# EAGLE design pong (EAGLE 6.2)
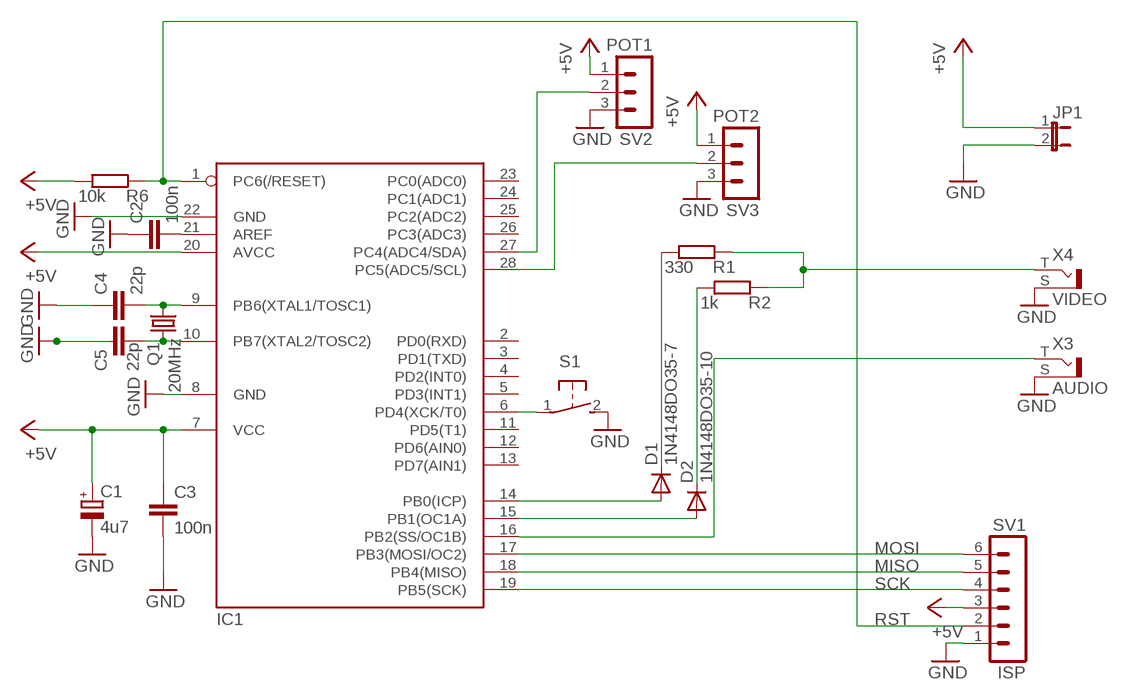
[diagram p0: schematic, sheet 1]

## Parts
C1  4u7  CPOL-EUTT5D7  [TT5D7]
C2  100n  C-EU025-024X044  [C025-024X044]
C3  100n  C-EU025-024X044  [C025-024X044]
C4  22p  C-EU025-024X044  [C025-024X044]
C5  22p  C-EU050-025X075  [C050-025X075]
D1  1N4148DO35-7  [DO35-7]
D2  1N4148DO35-10  [DO35-10]
IC1  MEGA8-P  [DIL28-3]
JP1  JP1E  [JP1]
Q1  20MHz  CRYSTALTC26V  [TC26V]
R1  330  R-EU_0204/5  [0204/5]
R2  1k  R-EU_0204/7  [0204/7]
R6  10k  R-EU_0207/15  [0207/15]
S1  31-XX  [B3F-31XX]
SV1  ISP  MA06-1  [MA06-1]
SV2  POT1  MA03-1  [MA03-1]
SV3  POT2  MA03-1  [MA03-1]
X3  AUDIO  WBTOR1  [WBTOR1]
X4  VIDEO  WBTOR1  [WBTOR1]

## Nets
+5V: C1.+ C3.1 IC1.7(VCC) IC1.20(AVCC) JP1.1 R6.1 SV1.3 SV2.1 SV3.1
GND: C1.- C2.1 C3.2 C4.1 C5.1 IC1.8(GND) IC1.22(GND) JP1.2 S1.2(S) SV1.1 SV2.3 SV3.3 X3.S X4.S
MISO: IC1.18(PB4(MISO)) SV1.5
MOSI: IC1.17(PB3(MOSI/OC2)) SV1.6
N$1: C2.2 IC1.21(AREF)
N$2: D1.A IC1.14(PB0(ICP))
N$3: IC1.27(PC4(ADC4/SDA)) SV2.2
N$4: IC1.28(PC5(ADC5/SCL)) SV3.2
N$5: D2.A IC1.15(PB1(OC1A))
N$6: D1.C R1.1
N$7: D2.C R2.1
N$9: IC1.6(PD4(XCK/T0)) S1.1(P)
N$11: R1.2 R2.2 X4.T
N$15: IC1.16(PB2(SS/OC1B)) X3.T
N$22: C4.2 IC1.9(PB6(XTAL1/TOSC1)) Q1.2
N$23: C5.2 IC1.10(PB7(XTAL2/TOSC2)) Q1.1
RST: IC1.1(PC6(/RESET)) R6.2 SV1.2
SCK: IC1.19(PB5(SCK)) SV1.4
Unconnected: IC1.2(PD0(RXD)) IC1.3(PD1(TXD)) IC1.4(PD2(INT0)) IC1.5(PD3(INT1)) IC1.11(PD5(T1)) IC1.12(PD6(AIN0)) IC1.13(PD7(AIN1)) IC1.23(PC0(ADC0)) IC1.24(PC1(ADC1)) IC1.25(PC2(ADC2)) IC1.26(PC3(ADC3))

## Library data of the parts
C1 = rcl:CPOL-EU: POLARIZED CAPACITOR, European symbol
C2-C5 = rcl:C-EU: CAPACITOR, European symbol
D1 D2 = diode:1N4148: DIODE high speed (Philips)
IC1 = atmel:MEGA8-P: MICROCONTROLLER 8 Kbytes FLASH, 1 kbytes SRAM, 512 bytes EEPROM, USART, 4-channel 10 bit ADC, 2-channel 8 bit ADC Pin compatible with Atmega48, ATMega88, ATMega168 Source: avr.lbr
JP1 = jumper:JP1E: JUMPER
Q1 = crystal:CRYSTAL: CRYSTAL
R1 R2 R6 = rcl:R-EU_: RESISTOR, European symbol
S1 = switch-omron:31-XX: OMRON SWITCH; MPN: B3F-3100; OC_FARNELL: 959704; OC_NEWARK: 36M3582
SV1 = con-lstb:MA06-1: PIN HEADER; OC_FARNELL: unknown; OC_NEWARK: unknown
SV2 SV3 = con-lstb:MA03-1: PIN HEADER; OC_FARNELL: unknown; OC_NEWARK: unknown
X3 X4 = con-lumberg:WBTOR1: RCA connectors according to JEITA RC-5231 Cinch RCA-Einbaukupplung nach JEITA RC-5231, abgewinkelte Ausführung Source: http://www.lumberg.de/Produkte/PDFs/WBTOR1.pdf; MPN: WBTOR 1 BLACK; OC_FARNELL: 1200146; OC_NEWARK: 98K2588

## Board
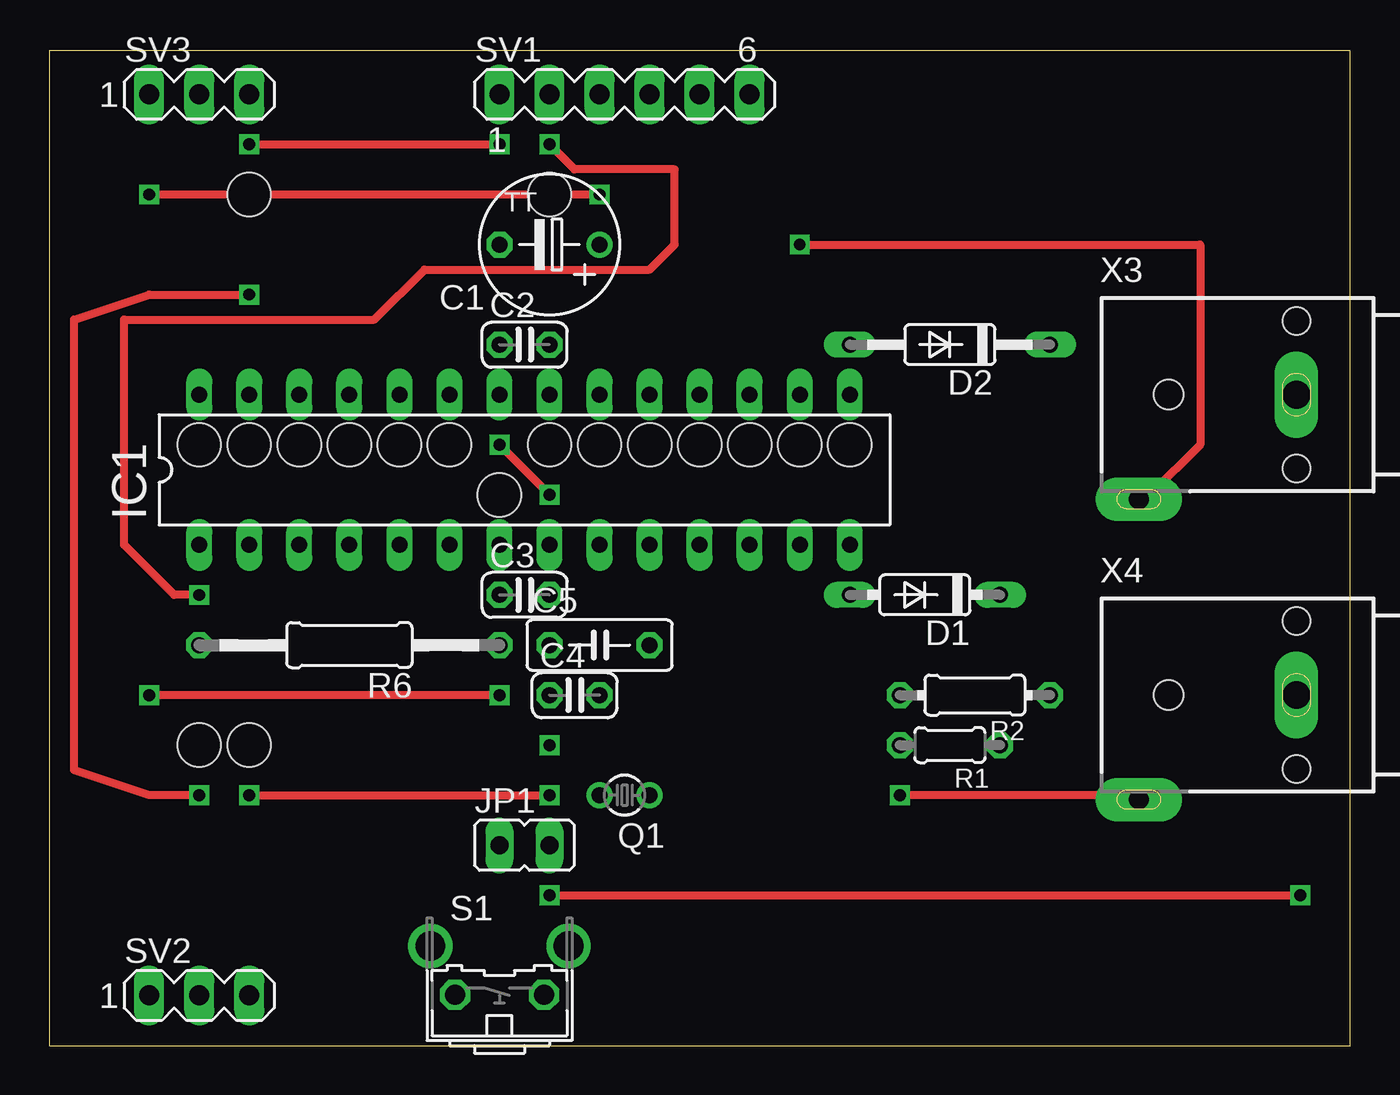
[diagram p1: board, top side]
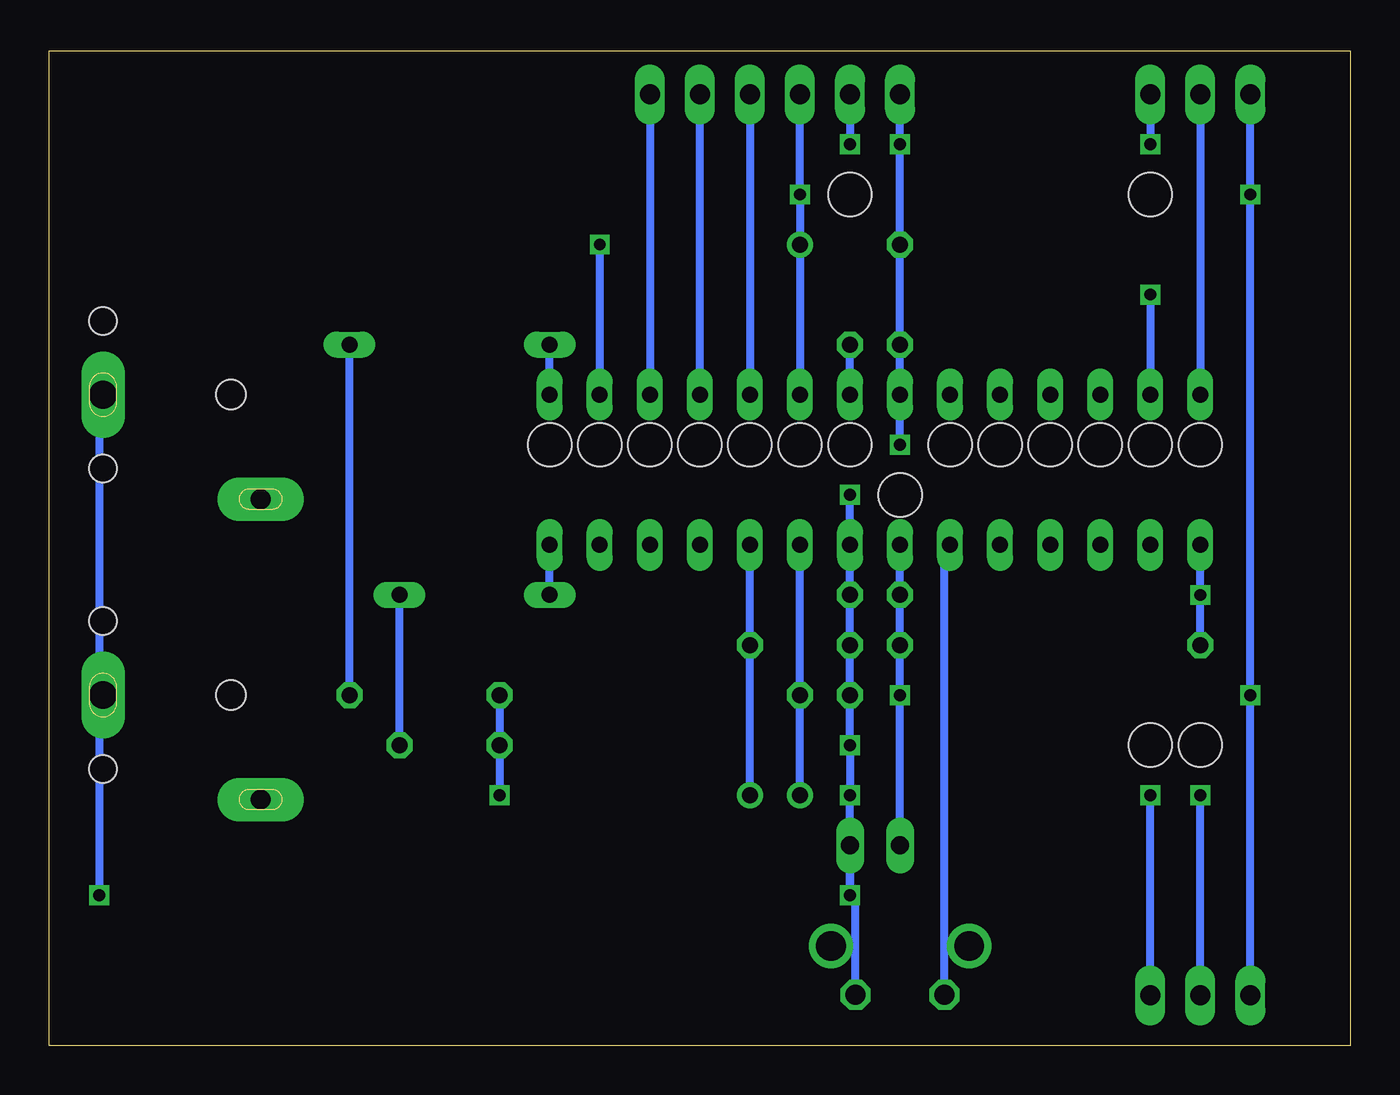
[diagram p2: board, bottom side, seen from below]

Size 66.03 x 50.47 mm. Coordinates in mm from the lower left corner, seen from the top.
Outline: 66.03,0 66.03,50.47 0,50.47 0,0 66.03,0
Copper layers (1*16): Top 0.035mm / dielectric 1.5mm / Bottom 0.035mm
Design rules: minimum track width 10mil, minimum drill 24mil, track to track 8mil, track to pad 8mil, pad to pad 8mil, via to via 8mil, smd to smd 8mil, copper to edge 40mil, drill to drill 8mil, minimum pad ring 10mil, minimum via ring 8mil, stop-mask expansion 4mil, vias tented up to drill 0mil, thermal gap 10mil
Holes 2.2 mm at 7.61,30.48 10.15,30.48 12.69,30.48 15.23,30.48 17.77,30.48 20.31,30.48 22.85,27.94 25.39,30.48 27.93,30.48 30.47,30.48 33.01,30.48 35.55,30.48 38.09,30.48 40.63,30.48 25.39,43.18 10.15,43.18 10.15,15.24 7.61,15.24

### Footprints (pad centres in the part's own frame; a part is rotated, then mirrored left to right if it is on the bottom)
TT5D7 = drill 0.813: + -2.54,0 | drill 0.813 octagon: - 2.54,0
C025-024X044 = drill 0.813 octagon: 1 -1.27,0; 2 1.27,0
C050-025X075 = drill 0.813 octagon: 1 -2.54,0; 2 2.54,0
DO35-7 = drill 0.813 long: A 3.81,0; C -3.81,0
DO35-10 = drill 0.813 long: A 5.08,0; C -5.08,0
DIL28-3 = drill 0.813 long: 1 -16.51,-3.81; 2 -13.97,-3.81; 3 -11.43,-3.81; 4 -8.89,-3.81; 5 -6.35,-3.81; 6 -3.81,-3.81; 7 -1.27,-3.81; 8 1.27,-3.81; 9 3.81,-3.81; 10 6.35,-3.81; 11 8.89,-3.81; 12 11.43,-3.81; 13 13.97,-3.81; 14 16.51,-3.81; 15 16.51,3.81; 16 13.97,3.81; 17 11.43,3.81; 18 8.89,3.81; 19 6.35,3.81; 20 3.81,3.81; 21 1.27,3.81; 22 -1.27,3.81; 23 -3.81,3.81; 24 -6.35,3.81; 25 -8.89,3.81; 26 -11.43,3.81; 27 -13.97,3.81; 28 -16.51,3.81
JP1 = drill 0.914 long: 1 0,-1.27; 2 0,1.27
TC26V = drill 0.813: 1 -1.27,0; 2 1.27,0
0204/5 = drill 0.813 octagon: 1 -2.54,0; 2 2.54,0
0204/7 = drill 0.813 octagon: 1 -3.81,0; 2 3.81,0
0207/15 = drill 0.813 octagon: 1 -7.62,0; 2 7.62,0
B3F-31XX = drill 1.016 octagon: 1 -2.261,-1.245; 2 2.261,-1.245 | drill 1.499 pad 2.159: 3 -3.505,1.245; 4 3.505,1.245
MA06-1 = drill 1.016 long: 1 -6.35,0; 2 -3.81,0; 3 -1.27,0; 4 1.27,0; 5 3.81,0; 6 6.35,0
MA03-1 = drill 1.016 long: 1 -2.54,0; 2 0,0; 3 2.54,0
WBTOR1 = drill 1.4 pad 2.2 long: S 0,-4 | drill 1 pad 2.2 long: T 5.3,-12 | hole 1.4: -3.75,-4; 3.75,-4 | hole 1.5: 0,-10.5

### Placement (x,y rotation side)
C1  25.39,40.64 180 top
C2  24.12,35.56 0 top
C3  24.12,22.86 0 top
C4  26.66,17.78 0 top
C5  27.93,20.32 0 top
D1  44.44,22.86 180 top
D2  45.71,35.56 180 top
IC1  24.12,29.21 0 top
JP1  24.12,10.16 270 top
Q1  29.2,12.7 180 top
R1  45.71,15.24 180 top
R2  46.98,17.78 180 top
R6  15.23,20.32 180 top
S1  22.85,3.81 0 top
SV1  29.2,48.26 0 top
SV2  7.61,2.54 0 top
SV3  7.61,48.26 0 top
X3  67.3,33.02 270 top
X4  67.3,17.78 270 top

### Tracks (layer width: path | path; a pad name or v marks a point on that pad's centre or on a via)
+5V  (via drill 0.6)
  Top 0.406: v22.85,17.78 v5.07,17.78 | v5.07,43.18 v27.93,43.18
  Bottom 0.406: IC1.7 C3.1 R6.1 v22.85,17.78 JP1.1 | IC1.20 C1.+ v27.93,43.18 SV1.3 | SV2.1 v5.07,17.78 v5.07,43.18 SV3.1
GND  (via drill 0.6)
  Top 0.406: v25.39,27.94 v22.85,30.48 | v10.15,12.7 v25.39,12.7 | v10.15,45.72 v22.85,45.72 | v25.39,7.62 v63.49,7.62
  Bottom 0.406: v22.85,30.48 IC1.22 C2.1 C1.- v22.85,45.72 SV1.1 | v25.39,27.94 IC1.8 C3.2 C5.1 C4.1 v25.39,15.24 v25.39,12.7 v25.39,7.62 | SV2.3 v10.15,12.7 | SV3.3 v10.15,45.72 | JP1.2 v25.39,7.62 | S1.2 25.11,7.62 v25.39,7.62 | X4.S 63.49,17.78 v63.49,7.62 63.49,33.02 X3.S
MISO
  Bottom 0.406: IC1.18 SV1.5
MOSI
  Bottom 0.406: SV1.6 IC1.17
N$1
  Bottom 0.406: IC1.21 C2.2
N$2
  Bottom 0.406: D1.A IC1.14
N$3  (via drill 0.6)
  Top 0.406: v7.61,12.7 5.07,12.7 1.26,13.97 1.26,36.83 5.07,38.1 v10.15,38.1
  Bottom 0.406: SV2.2 v7.61,12.7 | v10.15,38.1 IC1.27
N$4
  Bottom 0.406: SV3.2 IC1.28
N$5
  Bottom 0.406: IC1.15 D2.A
N$6
  Bottom 0.406: R1.1 D1.C
N$7
  Bottom 0.406: R2.1 D2.C
N$9
  Bottom 0.406: S1.1 20.59,25.4 IC1.6
N$11  (via drill 0.6)
  Top 0.406: X4.T 55.3,12.7 v43.17,12.7
  Bottom 0.406: R2.2 R1.2 v43.17,12.7
N$15  (via drill 0.6)
  Top 0.406: v38.09,40.64 58.41,40.64 58.41,30.48 55.87,27.94 55.87,27.72 X3.T
  Bottom 0.406: v38.09,40.64 IC1.16
N$22
  Bottom 0.406: Q1.2 C4.2 IC1.9
N$23
  Bottom 0.406: IC1.10 C5.2 Q1.1
RST  (via drill 0.6)
  Top 0.406: v7.61,22.86 6.34,22.86 3.8,25.4 3.8,36.83 16.5,36.83 19.04,39.37 30.47,39.37 31.74,40.64 31.74,44.45 26.66,44.45 v25.39,45.72
  Bottom 0.406: SV1.2 v25.39,45.72 | R6.2 v7.61,22.86 IC1.1
SCK
  Bottom 0.406: SV1.4 IC1.19

### Text on the board
Document: SCK | MISO | MOSI